# Altium schematic sheet хехема.SchDoc
size A2; Organization: Yandex; Address2: 11 Timura Frunze st., building 2; Release_Date: yyyy-mm-dd; Language: en; Organization2: Self Driving Group LLC
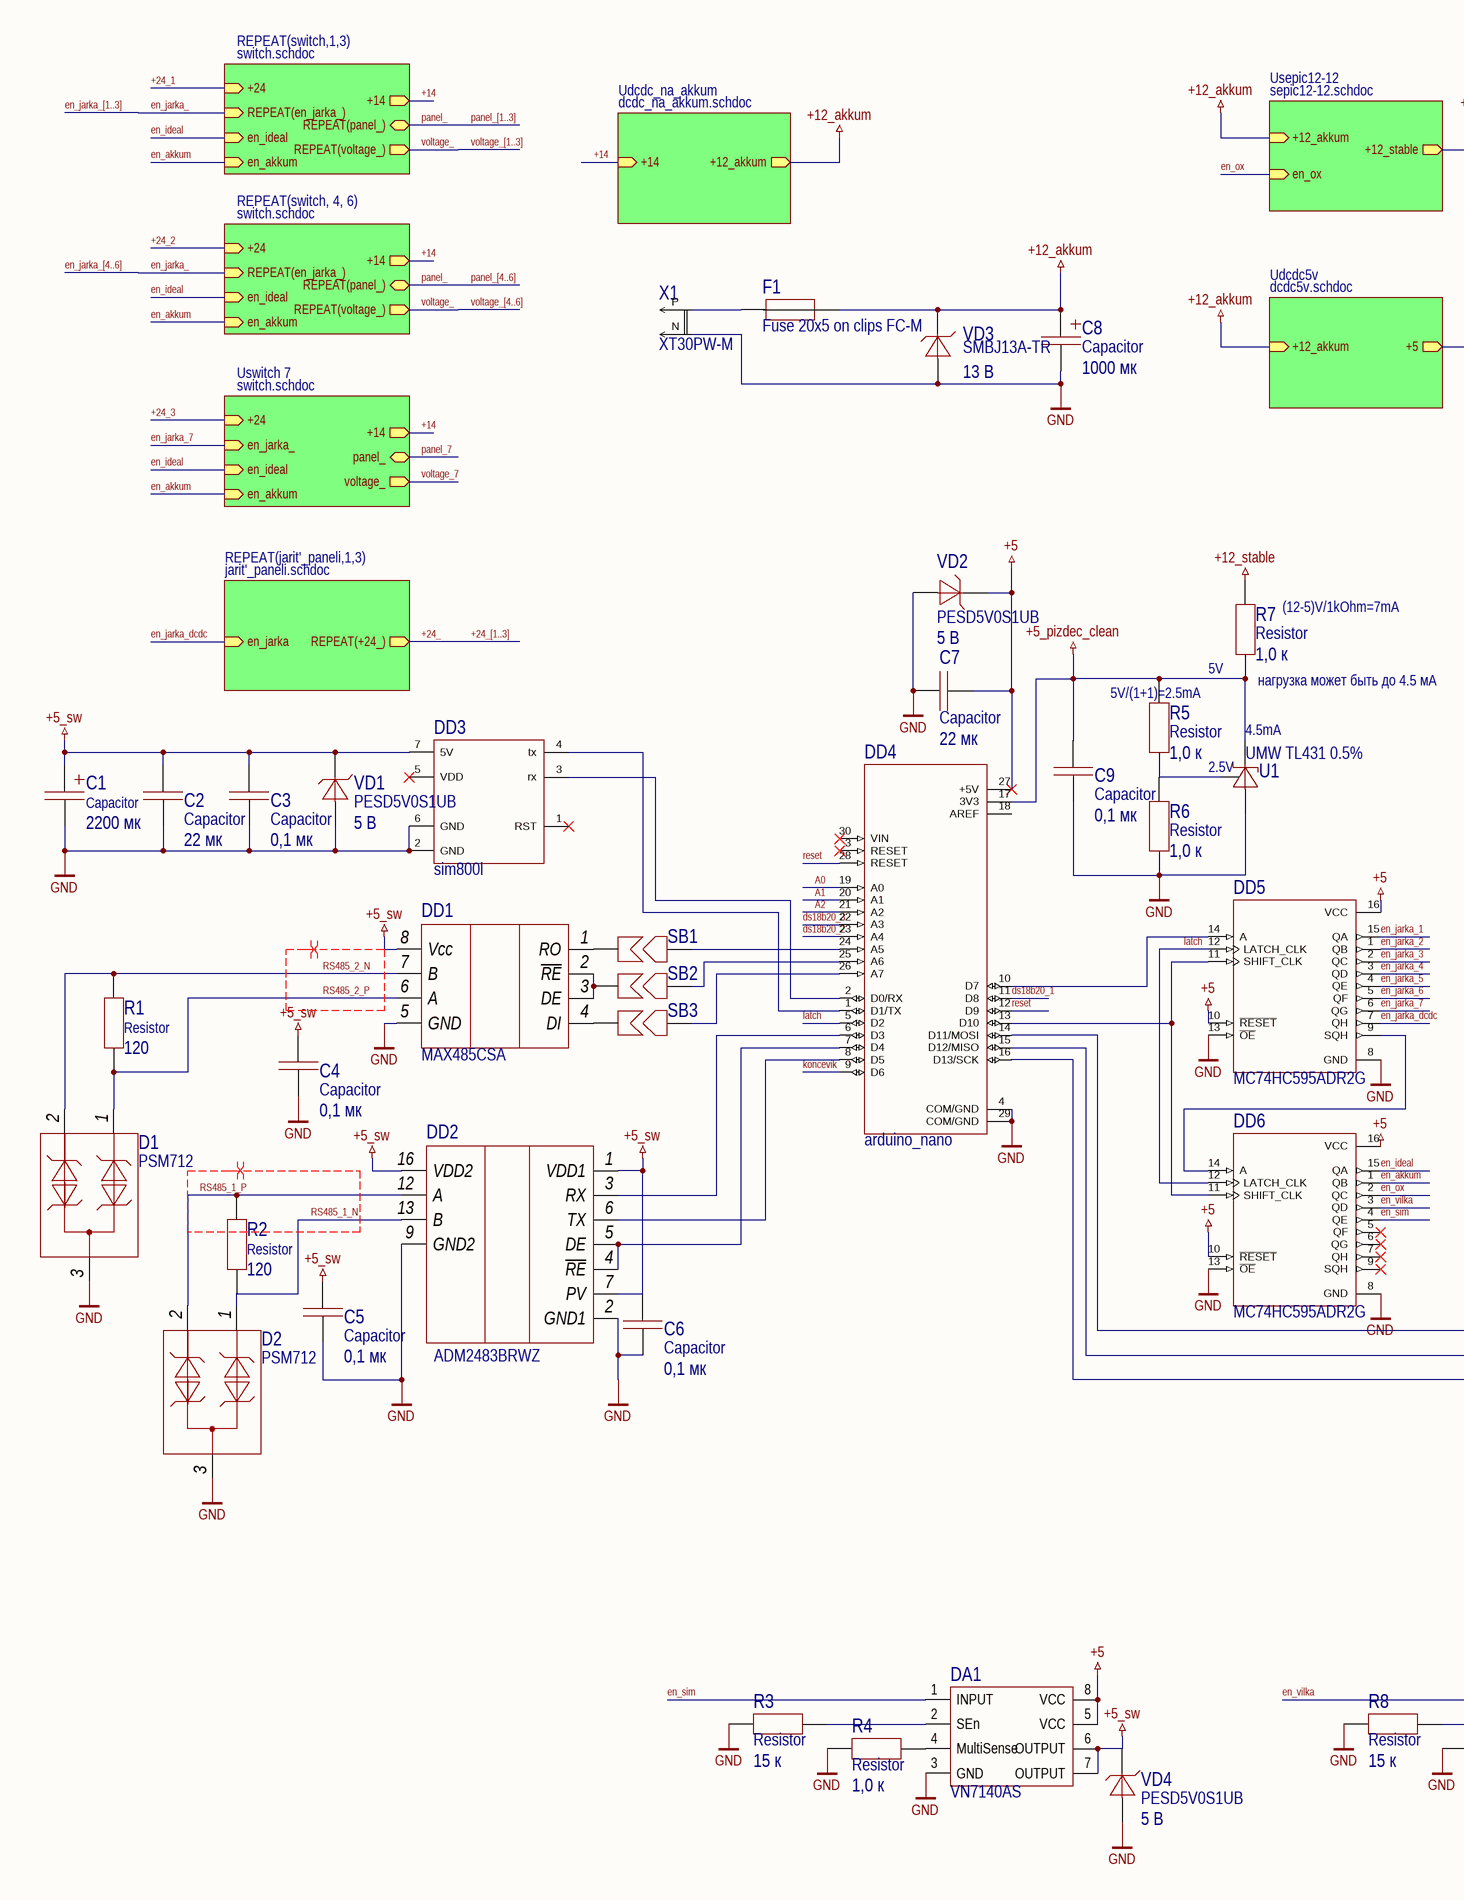
[diagram p0: хехема.SchDoc, left]
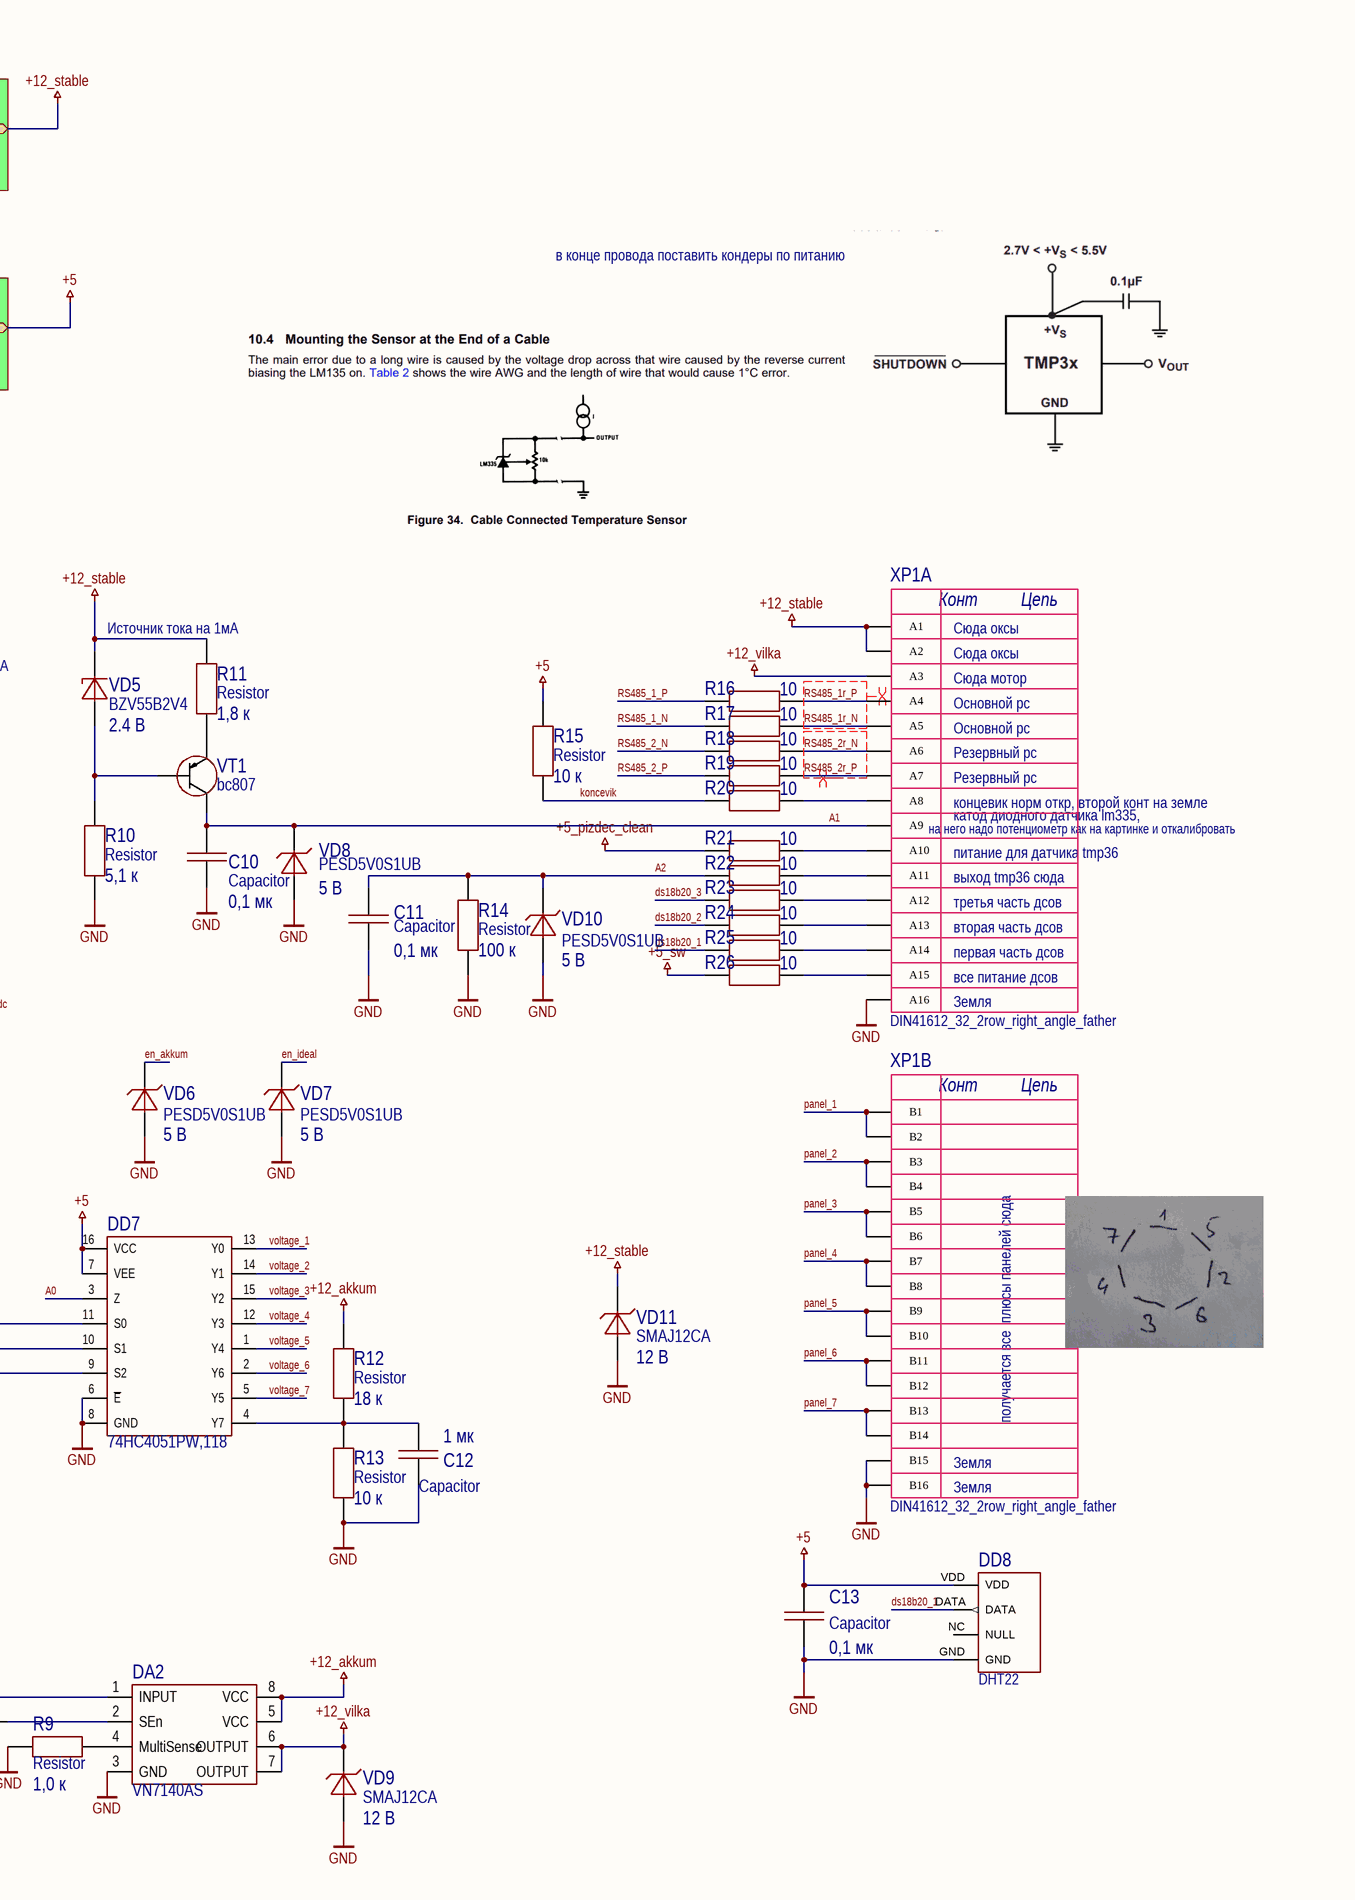
[diagram p1: хехема.SchDoc, right]

## Parts
C1  Capacitor  value 2200 мк  [10x20_radial]
C2  Capacitor  value 22 мк  [1210C]
C3  Capacitor  value 0,1 мк  [0603C]
C4  Capacitor  value 0,1 мк  [0603C]
C5  Capacitor  value 0,1 мк  [0603C]
C6  Capacitor  value 0,1 мк  [0603C]
C7  Capacitor  value 22 мк  [1210C]
C8  Capacitor  value 1000 мк  [SMD_cap_12,5x13,5]
C9  Capacitor  value 0,1 мк  [0603C]
C10  Capacitor  value 0,1 мк  [0603C]
C11  Capacitor  value 0,1 мк  [0603C]
C12  Capacitor  value 1 мк  [0603C]
C13  Capacitor  value 0,1 мк  [0603C]
D1  PSM712  [SOT23-3]
D2  PSM712  [SOT23-3]
DA1  VN7140AS  [SOP8]
DA2  VN7140AS  [SOP8]
DD1  MAX485CSA  [SOIC-8]
DD2  ADM2483BRWZ  [SOIC-16W]
DD3  sim800l  [sim800l]
DD4  arduino_nano  [arduino_nano]
DD5  MC74HC595ADR2G  [SOIC-16]
DD6  MC74HC595ADR2G  [SOIC-16]
DD7  74HC4051PW,118  [TSSOP-16]
DD8  DHT22  [DHT22]
F1  Fuse 20x5 on clips FC-M  [fuse_20x5_on_clips_FC-M]
R1  Resistor  value 120  [1206R]
R2  Resistor  value 120  [1206R]
R3  Resistor  value 15 к  [0603R]
R4  Resistor  value 1,0 к  [0603R]
R5  Resistor  value 1,0 к  [0603R]
R6  Resistor  value 1,0 к  [0603R]
R7  Resistor  value 1,0 к  [0603R]
R8  Resistor  value 15 к  [0603R]
R9  Resistor  value 1,0 к  [0603R]
R10  Resistor  value 5,1 к  [0603R]
R11  Resistor  value 1,8 к  [0603R]
R12  Resistor  value 18 к  [0603R]
R13  Resistor  value 10 к  [0603R]
R14  Resistor  value 100 к  [0603R]
R15  Resistor  value 10 к  [0603R]
R16  value 10  [0603R]  (hidden comment: Resistor)
R17  value 10  [0603R]  (hidden comment: Resistor)
R18  value 10  [0603R]  (hidden comment: Resistor)
R19  value 10  [0603R]  (hidden comment: Resistor)
R20  value 10  [0603R]  (hidden comment: Resistor)
R21  value 10  [0603R]  (hidden comment: Resistor)
R22  value 10  [0603R]  (hidden comment: Resistor)
R23  value 10  [0603R]  (hidden comment: Resistor)
R24  value 10  [0603R]  (hidden comment: Resistor)
R25  value 10  [0603R]  (hidden comment: Resistor)
R26  value 10  [0603R]  (hidden comment: Resistor)
SB1  SB  [0805SB]  (value not drawn)
SB2  SB  [0805SB]  (value not drawn)
SB3  SB  [0805SB]  (value not drawn)
U1  UMW TL431 0.5%  [SOT23-3]
VD1  PESD5V0S1UB  value 5 В  [SOD523]
VD2  PESD5V0S1UB  value 5 В  [SOD523]
VD3  SMBJ13A-TR  value 13 В  [SMB]
VD4  PESD5V0S1UB  value 5 В  [SOD523]
VD5  BZV55B2V4  value 2.4 В  [mini_MELF_3.5mm]
VD6  PESD5V0S1UB  value 5 В  [SOD523]
VD7  PESD5V0S1UB  value 5 В  [SOD523]
VD8  PESD5V0S1UB  value 5 В  [SOD523]
VD9  SMAJ12CA  value 12 В  [SMA]
VD10  PESD5V0S1UB  value 5 В  [SOD523]
VD11  SMAJ12CA  value 12 В  [SMA]
VT1  bc807  [SOT23-3]
X1  XT30PW-M  [XT30PW-M]
XP1  DIN41612_32_2row_right_angle_father  [DIN41612_32_2row_right_angle_father]  (parts A,B of 2)

## Sub-sheets
REPEAT(jarit'_paneli,1,3) = jarit'_paneli.schdoc: REPEAT(+24_) (out), en_jarka (in)
REPEAT(switch,1,3) = switch.schdoc: REPEAT(panel_) (bidir), REPEAT(en_jarka_) (in), +14 (out), en_ideal (in), en_akkum (in), +24 (in), REPEAT(voltage_) (out)
REPEAT(switch, 4, 6) = switch.schdoc: REPEAT(panel_) (bidir), REPEAT(en_jarka_) (in), +14 (out), +24 (in), en_ideal (in), en_akkum (in), REPEAT(voltage_) (out)
Udcdc5v = dcdc5v.schdoc: +5 (out), +12_akkum (in)
Udcdc_na_akkum = dcdc_na_akkum.schdoc: +14 (in), +12_akkum (out)
Usepic12-12 = sepic12-12.schdoc: +12_akkum (in), +12_stable (out), en_ox (in)
Uswitch 7 = switch.schdoc: panel_ (bidir), en_jarka_ (in), +14 (out), +24 (in), en_ideal (in), en_akkum (in), voltage_ (out)

## Nets
+5: C7.1 C13.2 DA1.5(VCC) DA1.8(VCC) DD4.27(+5V) DD5.10(~{RESET}) DD5.16(VCC) DD6.10(~{RESET}) DD6.16(VCC) DD7.7(VEE) DD7.16(VCC) DD8.VDD R15.2 VD2.2 ; sheet Udcdc5v/+5
+5_pizdec_clean: C9.2 DD4.17(3V3) R5.2 R7.1 R21.1 U1.2
+5_sw: C1.1 C2.2 C3.2 C4.1 C5.2 C6.2 DA1.6(OUTPUT) DA1.7(OUTPUT) DD1.8(Vcc) DD2.1(VDD1) DD2.7(PV) DD2.16(VDD2) DD3.7(5V) R26.1 VD1.2 VD4.2
+12_akkum: C8.1 DA2.5(VCC) DA2.8(VCC) F1.2 R12.2 VD3.2 ; sheet Udcdc5v/+12_akkum, sheet Udcdc_na_akkum/+12_akkum, sheet Usepic12-12/+12_akkum
+12_stable: R7.2 R11.2 VD5.2 VD11.2 XP1.A1 XP1.A2 ; sheet Usepic12-12/+12_stable
+12_vilka: DA2.6(OUTPUT) DA2.7(OUTPUT) VD9.2 XP1.A3
GND: C1.2 C2.1 C3.1 C4.2 C5.1 C6.1 C7.2 C8.2 C9.1 C10.1 C11.1 C12.1 C13.1 D1.3 D2.3 DA1.3(GND) DA2.3(GND) DD1.5(GND) DD2.2(GND1) DD2.9(GND2) DD3.2(GND) DD3.6(GND) DD4.4(COM/GND) DD4.29(COM/GND) DD5.8(GND) DD5.13(~{OE}) DD6.8(GND) DD6.13(~{OE}) DD7.6(~{E}) DD7.8(GND) DD8.GND R3.1 R4.1 R6.1 R8.1 R9.1 R10.1 R13.1 R14.1 U1.3 VD1.1 VD2.1 VD3.1 VD4.1 VD6.1 VD7.1 VD8.1 VD9.1 VD10.1 VD11.1 X1.N XP1.A16 XP1.B15 XP1.B16
+14: sheet REPEAT(switch,1,3)/+14, sheet Udcdc_na_akkum/+14, sheet REPEAT(switch, 4, 6)/+14, sheet Uswitch 7/+14
+24_: sheet REPEAT(jarit'_paneli,1,3)/REPEAT(+24_)
+24_1: sheet REPEAT(switch,1,3)/+24
+24_2: sheet REPEAT(switch, 4, 6)/+24
+24_3: sheet Uswitch 7/+24
A0: DD4.19(A0) DD7.3(Z)
A1: C10.2 DD4.20(A1) VD8.2 VT1.3 XP1.A9
A2: C11.2 DD4.21(A2) R14.2 R22.1 VD10.2
ds18b20_1: DD4.11(D8) DD8.DATA R25.1
ds18b20_2: DD4.23(A4) R24.1
ds18b20_3: DD4.22(A3) R23.1
en_akkum: DD6.1(QB) VD6.2 ; sheet REPEAT(switch,1,3)/en_akkum, sheet REPEAT(switch, 4, 6)/en_akkum, sheet Uswitch 7/en_akkum
en_ideal: DD6.15(QA) VD7.2 ; sheet REPEAT(switch,1,3)/en_ideal, sheet REPEAT(switch, 4, 6)/en_ideal, sheet Uswitch 7/en_ideal
en_jarka_: sheet REPEAT(switch,1,3)/REPEAT(en_jarka_), sheet REPEAT(switch, 4, 6)/REPEAT(en_jarka_)
en_jarka_1: DD5.15(QA)
en_jarka_2: DD5.1(QB)
en_jarka_3: DD5.2(QC)
en_jarka_4: DD5.3(QD)
en_jarka_5: DD5.4(QE)
en_jarka_6: DD5.5(QF)
en_jarka_7: DD5.6(QG) ; sheet Uswitch 7/en_jarka_
en_jarka_dcdc: DD5.7(QH) ; sheet REPEAT(jarit'_paneli,1,3)/en_jarka
en_ox: DD6.2(QC) ; sheet Usepic12-12/en_ox
en_sim: DA1.1(INPUT) DD6.4(QE)
en_vilka: DA2.1(INPUT) DD6.3(QD)
koncevik: DD4.9(D6) R15.1 R20.1
latch: DD4.5(D2) DD5.12(LATCH_CLK) DD6.12(LATCH_CLK)
panel_: sheet REPEAT(switch,1,3)/REPEAT(panel_), sheet REPEAT(switch, 4, 6)/REPEAT(panel_)
panel_1: XP1.B1 XP1.B2
panel_2: XP1.B3 XP1.B4
panel_3: XP1.B5 XP1.B6
panel_4: XP1.B7 XP1.B8
panel_5: XP1.B9 XP1.B10
panel_6: XP1.B11 XP1.B12
panel_7: XP1.B13 XP1.B14 ; sheet Uswitch 7/panel_
reset: DD4.12(D9) DD4.28(RESET)
RS485_1_N: D2.1 DD2.13(B) R2.1 R17.1
RS485_1_P: D2.2 DD2.12(A) R2.2 R16.1
RS485_1r_N: R17.2 XP1.A5
RS485_1r_P: R16.2 XP1.A4
RS485_2_N: D1.2 DD1.7(B) R1.2 R18.1
RS485_2_P: D1.1 DD1.6(A) R1.1 R19.1
RS485_2r_N: R18.2 XP1.A6
RS485_2r_P: R19.2 XP1.A7
voltage_: sheet REPEAT(switch,1,3)/REPEAT(voltage_), sheet REPEAT(switch, 4, 6)/REPEAT(voltage_)
voltage_1: DD7.13(Y0)
voltage_2: DD7.14(Y1)
voltage_3: DD7.15(Y2)
voltage_4: DD7.12(Y3)
voltage_5: DD7.1(Y4)
voltage_6: DD7.2(Y6)
voltage_7: DD7.5(Y5) ; sheet Uswitch 7/voltage_
NetC12_2: C12.2 DD7.4(Y7) R12.1 R13.2
NetDA1_2: DA1.2(SEn) R3.2
NetDA1_4: DA1.4(MultiSense) R4.2
NetDA2_2: DA2.2(SEn) R8.2
NetDA2_4: DA2.4(MultiSense) R9.2
NetDD1_1: DD1.1(RO) SB1.1
NetDD1_2: DD1.2(~{RE}) DD1.3(DE) SB2.1
NetDD1_4: DD1.4(DI) SB3.1
NetDD2_3: DD2.3(RX) DD4.6(D3)
NetDD2_4: DD2.4(~{RE}) DD2.5(DE) DD4.7(D4)
NetDD2_6: DD2.6(TX) DD4.8(D5)
NetDD3_3: DD3.3(rx) DD4.2(D0/RX)
NetDD3_4: DD3.4(tx) DD4.1(D1/TX)
NetDD4_10: DD4.10(D7) DD5.14(A)
NetDD4_13: DD4.13(D10) DD5.11(SHIFT_CLK) DD6.11(SHIFT_CLK)
NetDD4_14: DD4.14(D11/MOSI) DD7.11(S0)
NetDD4_15: DD4.15(D12/MISO) DD7.10(S1)
NetDD4_16: DD4.16(D13/SCK) DD7.9(S2)
NetDD4_24: DD4.24(A5) SB1.2
NetDD4_25: DD4.25(A6) SB2.2
NetDD4_26: DD4.26(A7) SB3.2
NetDD5_9: DD5.9(SQH) DD6.14(A)
NetF1_1: F1.1 X1.P
NetR5_1: R5.1 R6.2 U1.1
NetR10_2: R10.2 VD5.1 VT1.1
NetR11_1: R11.1 VT1.2
NetR20_2: R20.2 XP1.A8
NetR21_2: R21.2 XP1.A10
NetR22_2: R22.2 XP1.A11
NetR23_2: R23.2 XP1.A12
NetR24_2: R24.2 XP1.A13
NetR25_2: R25.2 XP1.A14
NetR26_2: R26.2 XP1.A15

Not connected (* = marked no-connect by the designer): DD3 1(RST)* 5(VDD)*; DD4 3(RESET)* 18(AREF) 30(VIN)*; DD6 5(QF)* 6(QG)* 7(QH)* 9(SQH)*; DD8 NC(NULL)

## Buses and harness runs
bus +24_[1..3]
bus en_jarka_[1..3]
bus en_jarka_[4..6]
bus panel_[1..3]
bus panel_[4..6]
bus voltage_[1..3]
bus voltage_[4..6]

## Layout directives
differential pair: RS485_1_N, RS485_1_P, RS485_1r_N, RS485_1r_P, RS485_2_N, RS485_2_P, RS485_2r_N, RS485_2r_P

## Notes on the sheet
- в конце провода поставить кондеры по питанию
- (near R7) (12-5)V/1kOhm=7mA
- Источник тока на 1мА
- Сюда оксы
- (near R5) 5V/(1+1)=2.5mA
- (near R7) 5V
- (near R7) нагрузка может быть до 4.5 мА
- Сюда мотор
- (near U1) 2.5V
- (near U1) 4.5mA
- Основной рс
- Резервный рс
- (near XP1) на него надо потенциометр как на картинке и откалибровать
- катод диодного датчика lm335,
- концевик норм откр, второй конт на земле
- питание для датчика tmp36
- выход tmp36 сюда
- первая часть дсов
- вторая часть дсов
- третья часть дсов
- все питание дсов
- Земля
- плюсы панелей сюда
- получается все
- 1
- 2
- 3
- 4
- 5
- 6
- 7
- 8
- A
- B
- C
- D
- E
- Responsible department
- Technical reference
- Document type
- Document status
- F
- Legal owner
- Created by
- Schematic drawing
- Title, Supplementary title
- CONFIDENTIAL
- Yandex
- Commercial secret
- Self Driving Group LLC
- Approved by
- Doc Rev.
- Date of Issue
- Lang.
- Sheet
- A3
- (in symbol DIN41612_32_2row_right_angle_father, part A) Конт; Цепь
- (in symbol DIN41612_32_2row_right_angle_father, part B) Конт; Цепь

## Library data of the parts
C1 = Capacitor_2200u_10V_10x20: Конденсатор радиальный 2200мкФ 10В ±20% 10*19; Tolerance: 20; Voltage (V): 10; Type: Aluminum; Capacity (uF): 2200; Part Number: Capacitor_2200u_10V_10x20
C2 C7 = Capacitor_22u_10_25V_X7R_1210C: Конденсатор; Tolerance: 0,1; Voltage (V): 25; Dielectric: X7R; Capacity (nF): 22000; Part Number: Capacitor_22u_10_25V_X7R_1210C
C3-C6 C9-C11 C13 = Capacitor_0,1u_10_50V_X7R_0603C: Конденсатор; Tolerance: 0,1; Voltage (V): 50; Dielectric: X7R; Capacity (nF): 100; Part Number: Capacitor_0,1u_10_50V_X7R_0603C
C8 = EEVFK1E102Q: Конденсатор алюминиевый электролитический 1000мкФ 25В 20% Low ESR 1100мА SMD12.5x13.5мм; Tolerance: 20; Voltage (V): 25; Type: Aluminum; Capacity (uF): 1000; Part Number: EEVFK1E102Q
C12 = Capacitor_1u_10_50V_X7R_0603C: Конденсатор; Tolerance: 0,1; Voltage (V): 50; Dielectric: X7R; Capacity (nF): 1000; Part Number: Capacitor_1u_10_50V_X7R_0603C
D1 D2 = PSM712: Защитный диод для линии RS-485; Part Number: PSM712; Interface: RS-485
DA1 DA2 = VN7140AS: Силовой ключ верхнего плеча с аналоговой обратной связью MultiSense автомобильного применения; Part Number: VN7140AS
DD1 = MAX485CSA: RS-485 приёмопередатчик; Part Number: MAX485CSA
DD2 = ADM2483BRWZ: Прием передатчик RS485 с гальванической развязкой; Part Number: ADM2483BRWZ
DD3 = sim800l: Четырехдиапазонный GSM/GPRS модуль, частоты: GSM 850 МГц, EGSM 900 МГц, DCS 1800 МГц и PCS 1900 МГц.; Part Number: sim800l
DD4 = arduino_nano: ардуинка на стойках; MP: Arduino Nano; Check_prices: https://www.snapeda.com/parts/Arduino%20Nano/Arduino/view-part/?ref=eda; Value: *; Availability: Not in stock; Price: None; Package: Non-Standard Arduino; SnapEDA_Link: https://www.snapeda.com/parts/Arduino%20Nano/Arduino/view-part/?ref=snap; MF: Arduino; Part Number: arduino_nano
DD5 DD6 = MC74HC595ADR2G: 8-ми битный сдвиговый регистр; Part Number: MC74HC595ADR2G
DD7 = 74HC4051PW,118: Мультиплексор аналоговый 8 в 1 КМОП кристалл, TSSOP16; Part Number: 74HC4051PW,118
DD8 = DHT22: Датчик температуры и влажности на базе AM2302; Part Number: DHT22
F1 = Fuse 20x5 on clips FC-M: Предохранитель 20*5 на креплениях; Value: {Номинал}; Part Number: Fuse 20x5 on clips FC-M
R1 R2 = Resistor_120_1_0603: Резистор номиналом 120 Ом и точностью 1%; Power: *; Part Number: Resistor_120_1_0603; Tolerance: 1%
R3 R8 = Resistor_15k_1_0603: Резистор номиналом 15 кОм и точностью 1%; Power: *; Part Number: Resistor_15k_1_0603; Tolerance: 1%
R4-R7 R9 = Resistor_1.0k_1_0603: Резистор номиналом 1,0 кОм и точностью 1%; Power: *; Part Number: Resistor_1.0k_1_0603; Tolerance: 1%
R10 = Resistor_5.1k_1_0603: Резистор номиналом 5,1 кОм и точностью 1%; Power: *; Part Number: Resistor_5.1k_1_0603; Tolerance: 1%
R11 = Resistor_1.8k_1_0603: Резистор номиналом 1,8 кОм и точностью 1%; Power: *; Part Number: Resistor_1.8k_1_0603; Tolerance: 1%
R12 = Resistor_18k_1_0603: Резистор номиналом 18 кОм и точностью 1%; Power: *; Part Number: Resistor_18k_1_0603; Tolerance: 1%
R13 R15 = Resistor_10k_1_0603: Резистор номиналом 10 кОм и точностью 1%; Power: *; Part Number: Resistor_10k_1_0603; Tolerance: 1%
R14 = Resistor_100k_1_0603: Резистор номиналом 100 кОм и точностью 1%; Power: *; Part Number: Resistor_100k_1_0603; Tolerance: 1%
R16-R26 = Resistor_10_1_0603: Резистор номиналом 10 Ом и точностью 1%; Power: *; Part Number: Resistor_10_1_0603; Tolerance: 1%
SB1-SB3 = SB: Solder bridge, мост припоя, запаиваемая перемычка, net tie, jumper; Part Number: SB
U1 = UMW TL431 0.5%: Источник опорного напряжения , программируемый стабилитрон [SOT-23-3]; Part Number: UMW TL431 0.5%
VD1 VD2 VD4 VD6-VD8 VD10 = PESD5V0S1UB: Защитный диод на 5 В, рассеиваемая мощность 330 Вт; Voltage nominal (V): 5; Power (W): 330; Part Number: PESD5V0S1UB
VD3 = SMBJ13A-TR: Защитный диод на 13 В, рассеиваемая мощность 600 Вт; Voltage nominal (V): 13; Power (W): 600; Part Number: SMBJ13A-TR
VD5 = BZV55B2V4: Стабилитрон на 2.4 В, рассеиваемая мощность 0.5 Вт; Voltage nominal (V): 2.4; Current nominal (mA): 5; Power (W): 0.3; Part Number: BZV55B2V4
VD9 VD11 = SMAJ12CA: Защитный диод на 12 В, рассеиваемая мощность 400 Вт; Voltage nominal (V): 12; Power (W): 400; Part Number: SMAJ12CA
VT1 = bc807: Биполярный транзистор PNP 45В 0.5А 0.31Вт; Part Number: bc807; Напряжение С-И/К-Э: 45 В; Ток макс#: 0.5 А
X1 = XT30PW-M: 30 А (15 продолжительно), 2 контакта разъем угловой отец; Part Number: XT30PW-M
XP1 = DIN41612_32_2row_right_angle_father: DIN41612R (DS1118-32M0R23), Разъем (вилка) тип B 32pin (2х16), шаг 2.54мм двухрядный угловой (ряд АВ); Part Number: DIN41612_32_2row_right_angle_father